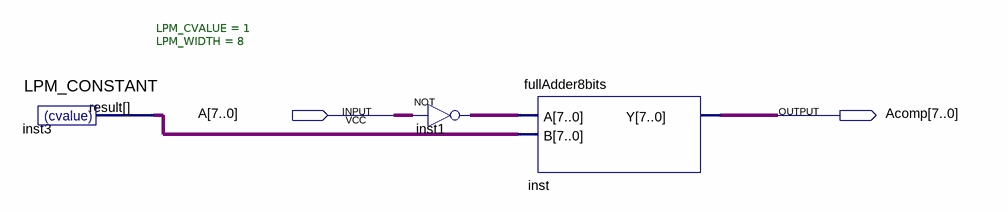
[diagram p0: schematic sheet]
// Quartus schematic complement2.bdf as structural Verilog: 3 symbols, 2 pins
module complement2 (
  input  [7:0] A,
  output [7:0] Acomp
);

  wire [7:0] inst1_out, inst3_result;

  LPM_CONSTANT #(.LPM_CVALUE(1), .LPM_WIDTH(8)) inst3 (.result(inst3_result));
  assign inst1_out = ~A;  // NOT inst1, 8 bits wide
  fullAdder8bits inst (.A(inst1_out), .B(inst3_result), .Y(Acomp));
endmodule
